# EasyEDA Pro project rm校内赛.eprj

# Schematic Schematic1
Board Name: Board1; Create Date: 2024-11-15; Page Name: P1; Project Name: rm校内赛; Schematic Name: Schematic1; Update Date: 2024-11-25; Company: 嘉立创EDA; Page Size: A4; Version: V1.0
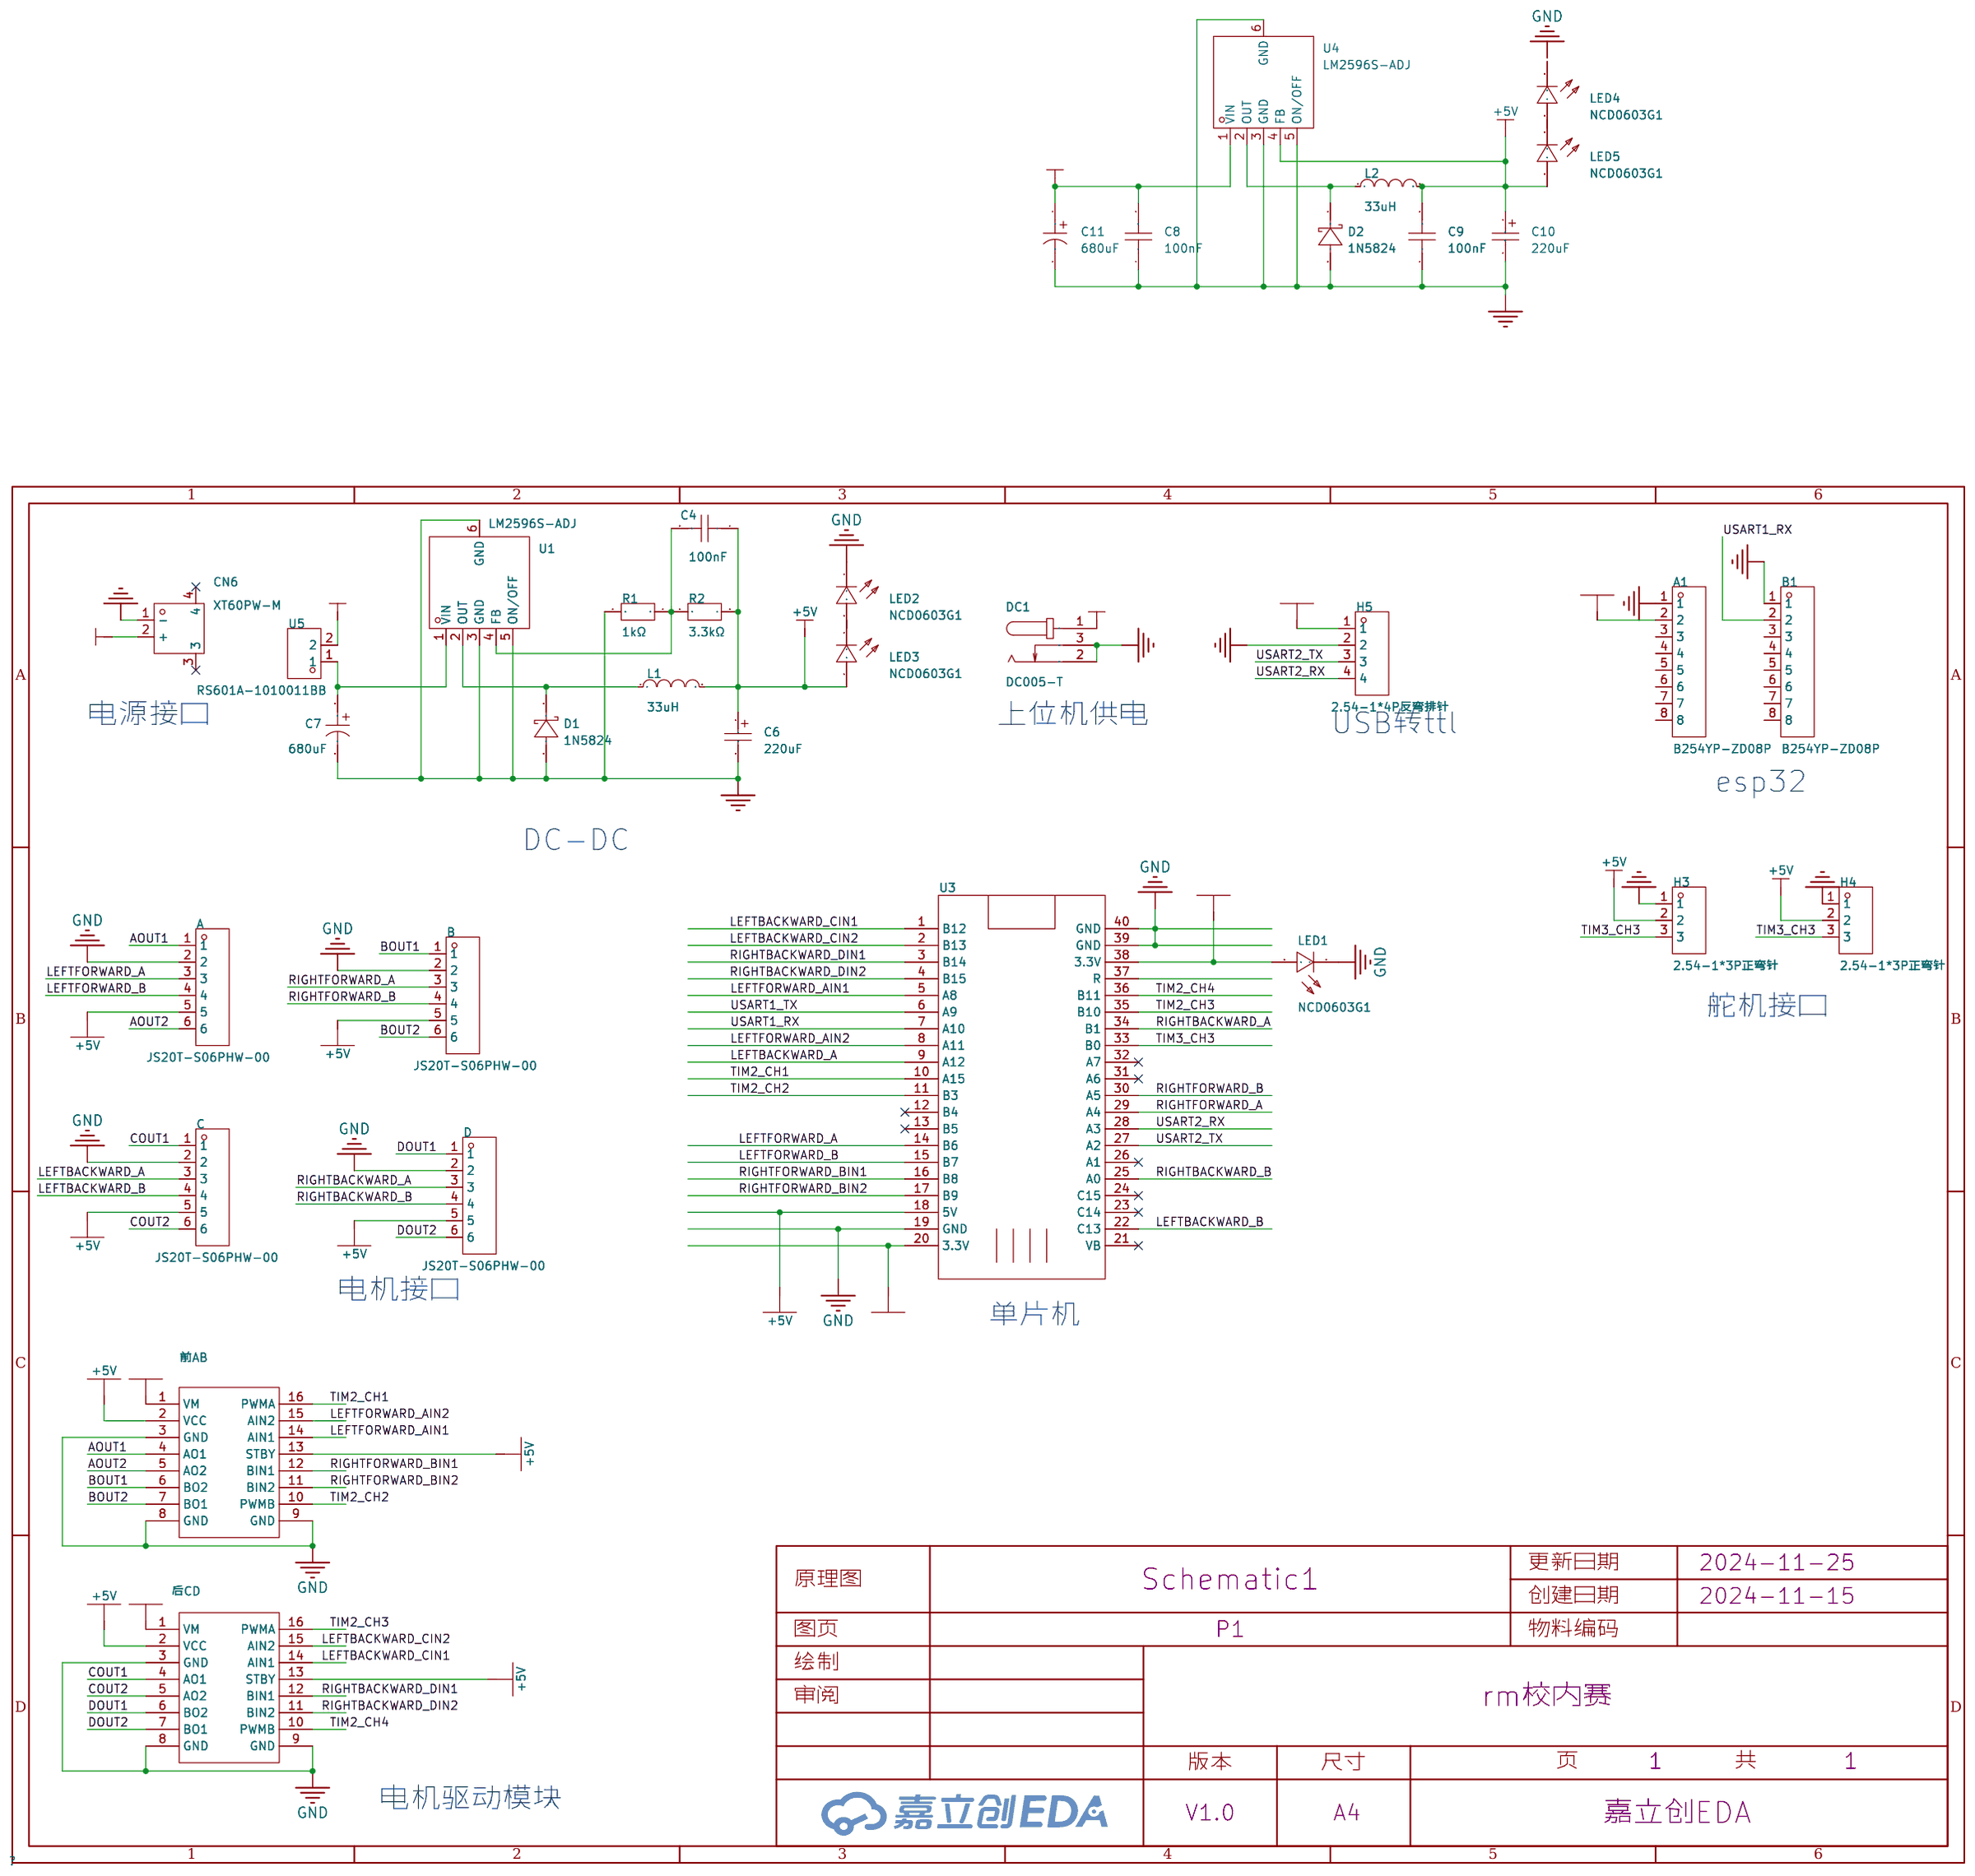
[diagram p0: schematic sheet]

## Parts
A  JS20T-S06PHW-00  [CONN-TH_6P-P2.00_JS20T-S06PHW-00]
A1  B254YP-ZD08P  [HDR-TH_8P-P2.54-V-F]
B  JS20T-S06PHW-00  [CONN-TH_6P-P2.00_JS20T-S06PHW-00]
B1  B254YP-ZD08P  [HDR-TH_8P-P2.54-V-F]
C  JS20T-S06PHW-00  [CONN-TH_6P-P2.00_JS20T-S06PHW-00]
C4  100nF  [C0603]
C6  220uF  [CASE-B_3528]
C7  680uF  [CAP-SMD_BD10.0-L10.3-W10.3-LS10.9-FD]
C8  100nF  [C0603]
C9  100nF  [C0603]
C10  220uF  [CASE-B_3528]
C11  680uF  [CAP-SMD_BD10.0-L10.3-W10.3-LS10.9-FD]
CN6  XT60PW-M  [CONN-TH_XT60PW-M]
D  JS20T-S06PHW-00  [CONN-TH_6P-P2.00_JS20T-S06PHW-00]
D1  1N5824  [DO-27_BD5.3-L8.4-P12.40-D1.3-RD]
D2  1N5824  [DO-27_BD5.3-L8.4-P12.40-D1.3-RD]
DC1  DC005-T  [DC-IN-TH_DC005-T]
H3  2.54-1*3P正弯针  [HDR-TH_3P-P2.54-H-M-BW7.2-P]
H4  2.54-1*3P正弯针  [HDR-TH_3P-P2.54-H-M-BW7.2-P]
H5  2.54-1*4P反弯排针  [HDR-TH_4P-P2.54-H-M-W10.4]
L1  33uH  [IND-SMD_L7.0-W6.6_FXL0630]
L2  33uH  [IND-SMD_L7.0-W6.6_FXL0630]
LED1  NCD0603G1  [LED0603-RD_1]
LED2  NCD0603G1  [LED0603-RD_1]
LED3  NCD0603G1  [LED0603-RD_1]
LED4  NCD0603G1  [LED0603-RD_1]
LED5  NCD0603G1  [LED0603-RD_1]
R1  1kΩ  [R0603]
R2  3.3kΩ  [R0603]
U1  LM2596S-ADJ  [TO-263-5_L10.0-W8.4-P1.70-LS15.3-BR]
U3  -  [STM32F103C8T6核心板]
U4  LM2596S-ADJ  [TO-263-5_L10.0-W8.4-P1.70-LS15.3-BR]
U5  RS601A-1010011BB  [SW-TH_RS601A-1010011BB]
前AB  -  [TB6612FNG Module - 8pin x 2]
后CD  -  [TB6612FNG Module - 8pin x 2]

## Library data of the parts
A B C D = JS20T-S06PHW-00: Supplier Part: C7499306; Manufacturer: JS(钜硕电子); Supplier Footprint: 插件,P=2.0mm; JLCPCB Part Class: 扩展库; Datasheet: https://atta.szlcsc.com/upload/public/pdf/source/20230809/E6337CD797A912ED7011A9EA7A78FFDE.pdf; Supplier: LCSC; Pins Structure: 1x6P; Pitch: 2mm; Mounting Style: 弯插; Reference Series: PH; Number of Pins: 6P; Number of Rows: 1; Number of PINs Per Row: 6; Contact Material: 黄铜; Check: false
A1 B1 = B254YP-ZD08P: LCSC Part Name: 排母 间距：2.54mm 1x8P 直插 方孔; Supplier Part: C41413862; Manufacturer: BXCONN(宝讯); Supplier Footprint: 插件,P=2.54mm; JLCPCB Part Class: 扩展库; Datasheet: https://atta.szlcsc.com/upload/public/pdf/source/20240923/74E2CE436646B459B413A9EB99F952A2.pdf; Supplier: LCSC; Holes Structure: 1x8P; Pitch: 2.54mm; Circular Hole / Square Hole: 方孔; Mounting Type: 直插; Number of Rows: 单排; Number of Holes: 8P; Current Rating (Max): 3A; Holes Direction: 顶部; Insulation Height: 8.5mm; Operating Temperature Range: -40℃~+105℃; Check: false
C4 C8 C9 = 06035L104K4T2A: LCSC Part Name: 100nF ±10% 50V; Supplier Part: C2167596; Manufacturer: Kyocera AVX; Supplier Footprint: 0603; JLCPCB Part Class: 扩展库; Datasheet: https://atta.szlcsc.com/upload/public/pdf/source/20211207/6F4035DE01556DFAFEB5EDE5432599E9.pdf; Supplier: LCSC; Tolerance: ±10%; Voltage Rated: 50V; Temperature Coefficient: X8L
C6 C10 = TLJB227M006R0500: LCSC Part Name: 220uF ±20% 6.3V; Supplier Part: C30242; Manufacturer: Kyocera AVX; Supplier Footprint: CASE-B-3528; JLCPCB Part Class: 扩展库; Datasheet: https://atta.szlcsc.com/upload/public/pdf/source/20181016/C313517_95E099C94D57B8A6005DAF15C3058A23.pdf; Supplier: LCSC; Tolerance: ±20%; Rated Voltage: 6.3V; Equivalent Series Resistance(ESR): 500mΩ@100kHz; Operating Temperature: -55℃~+125℃
C7 C11 = GVM1V681M1010: LCSC Part Name: 680uF ±20% 35V; Supplier Part: C2980172; Manufacturer: HONOR(荣誉); Supplier Footprint: SMD,D10xL10.5mm; JLCPCB Part Class: 扩展库; Datasheet: https://atta.szlcsc.com/upload/public/pdf/source/20220509/EB2A569F0F3393644DE07704993C28AA.pdf; Supplier: LCSC; Tolerance: ±20%; Rated Voltage: 35V; Ripple Current: 1.19A@120Hz; Equivalent Series Resistance(ESR): 60mΩ@120Hz; φD: 10mm; L: 10.2mm; Lifetime @ Temp: 5000hrs@105℃; Operating Temperature: -55℃~+105℃
CN6 = XT60PW-M: LCSC Part Name: AMASS(艾迈斯)航模插头xt60连接器150公母对接pw锂电池公头 板插卧式XT60PW-M; Supplier Part: C98732; Manufacturer: AMASS(艾迈斯); JLCPCB Part Class: 扩展库; Datasheet: https://atta.szlcsc.com/upload/public/pdf/source/20240118/44A3DCFF53BE25DC65378AFFB21277A4.pdf; Supplier: LCSC; Brand: 艾迈斯; Type: 卧式插头; Colour: 黄色; InterfaceType: 公头
D1 D2 = 1N5824_C7503125: LCSC Part Name: 电压:30V 电流:5A; Supplier Part: C7503125; Manufacturer: FUXINSEMI(富芯森美); Supplier Footprint: DO-201AD; JLCPCB Part Class: 扩展库; Datasheet: https://atta.szlcsc.com/upload/public/pdf/source/20230904/20F3394C6D1B7A17743713246CA97DB3.pdf; Supplier: LCSC; Diode Configuration: 独立式; Forward Voltage (Vf@If): 550mV@5A; Reverse Voltage (Vr): 30V; Average Rectified Current (Io): 5A; Reverse Leakage Current (Ir): 500uA@30V; Peak forward surge current: 150A
DC1 = DC005-T: LCSC Part Name: DC电源插座 内径:2mm 外径:6.3mm; Supplier Part: C431532; Manufacturer: SHOU HAN(首韩); Supplier Footprint: 插件; JLCPCB Part Class: 扩展库; Datasheet: https://atta.szlcsc.com/upload/public/pdf/source/20190925/C431532_27AF2D37554BC0900100E1656035C16A.pdf; Supplier: LCSC; Connector Type: DC电源插座; Mounting Style: 弯插; Inside Contact Diameter: 2mm; Outside Contact Diameter: 6.3mm; Current Rating (Max): 500mA; Voltage Rating (Max): 30V; Operating Temperature Range: -40℃~+55℃
H3 H4 = 2.54-1*3P正弯针: LCSC Part Name: 间距:2.54mm 1x3P 弯插 方针; Supplier Part: C92159; Manufacturer: BOOMELE(博穆精密); Supplier Footprint: 弯插,P=2.54mm; JLCPCB Part Class: 扩展库; Datasheet: https://atta.szlcsc.com/upload/public/pdf/source/20181121/C2334_B051029C4931EB562F9DCCAAD18AC88A.pdf; Supplier: LCSC; Pin Structure: 1x3P; Pitch: 2.54mm; Circluar Pins/Square Pins: 方针; Mounting Type: 弯插; Number of Rows: 单排; Number of Pins: 3P; Current Rating (Max): 3A; Length of Mating Pin: 3mm; Insulation Height: 2.54mm; Operating Temperature Range: -55℃~+105℃; Color: 黑色
H5 = 2.54-1*4P反弯排针: LCSC Part Name: 间距:2.54mm 1x4P 弯插 方针; Supplier Part: C91552; Manufacturer: BOOMELE(博穆精密); Supplier Footprint: 弯插,P=2.54mm; JLCPCB Part Class: 扩展库; Datasheet: https://atta.szlcsc.com/upload/public/pdf/source/20190508/C74252_03DDEC4696EE17172E44B96636392962.pdf; Supplier: LCSC; Pin Structure: 1x4P; Pitch: 2.54mm; Circluar Pins/Square Pins: 方针; Mounting Type: 弯插; Number of Rows: 单排; Number of Pins: 4P; Current Rating (Max): 3A; Length of Mating Pin: 6mm; Operating Temperature Range: -55℃~+105℃; Color: 黑色
L1 L2 = FXL0630-330-M: LCSC Part Name: 33uH ±20% 2.5A; Supplier Part: C177245; Manufacturer: cjiang(长江微电); Supplier Footprint: SMD,6.6x7mm; JLCPCB Part Class: 扩展库; Datasheet: https://atta.szlcsc.com/upload/public/pdf/source/20240426/3189EA8206330E2108542F9E34E540E7.pdf; Supplier: LCSC; Tolerance: ±20%; Rated Current: 2A; Saturation Current (Isat): 2.5A; DC Resistance (DCR): 310mΩ; Type: 一体成型电感
LED1-LED5 = NCD0603G1: Supplier Part: C84267; Manufacturer: 国星光电; Supplier Footprint: 0603; JLCPCB Part Class: 扩展库; Datasheet: https://atta.szlcsc.com/upload/public/pdf/source/20200820/C84267_04BA7703640BAC111D09F5EFB971FBF3.pdf; Supplier: LCSC; Emitted Color: 翠绿色; Forward Voltage (VF): 2.6V~3.6V; Power Dissipation: 72mW; Forward Current: 10mA; Dominant Wavelength: 515nm~530nm; Lens Color: 无色透明透镜; Luminous Intensity: 330mcd~900mcd; Viewing Angle: 130°; Operating Temperature: -30℃~+85℃
R1 R2 = FRC0603J103TS: LCSC Part Name: 10kΩ ±5% 100mW 厚膜电阻; Supplier Part: C2930027; Manufacturer: FOJAN(富捷); Supplier Footprint: 0603; JLCPCB Part Class: Extended Part; Datasheet: https://atta.szlcsc.com/upload/public/pdf/source/20211221/925EC7D7225764EE0046F22065062C87.pdf; Supplier: LCSC; Type: 厚膜电阻; Tolerance: ±5%; Power(Watts): 100mW; Overload Voltage (Max): 75V; Temperature Coefficient: ±100ppm/℃; Operating Temperature Range: -55℃~+155℃
U1 U4 = LM2596S-ADJ_C5349987: Supplier Part: C5349987; Manufacturer: HXY MOSFET(华轩阳电子); Supplier Footprint: TO-263-5L; JLCPCB Part Class: 扩展库; Datasheet: https://atta.szlcsc.com/upload/public/pdf/source/20230111/199BC35A7A4D0647B85E7DE5CE9FEA7F.pdf; Supplier: LCSC; Function: 降压型; Output Type: 可调; Input Voltage: 40V; Output Voltage: 1.23V~37V; Output Current (Max): 3.5A; Operating Temperature: -40℃~+125℃; Number of Outputs: 1; Switch tube (built-in/external): 内置
U3 = stm32f103c8t6最小系统板: Check: false
U5 = RS601A-1010011BB_C2885779: Supplier Part: C2885779; Manufacturer: HCTL(华灿天禄); Supplier Footprint: 插件; JLCPCB Part Class: 扩展库; Datasheet: https://atta.szlcsc.com/upload/public/pdf/source/20210820/CD80D5B25FB294BFDCE06549B0FB3C50.pdf; Supplier: LCSC; Switch Length: 21mm; Switch Width: 15mm; Switch Height: 13.6mm; Actuator Type: 凹面弯曲; With Lamp: 无; Pin Style: 焊片; Actuator Color: 黑色; Contact Current: 6A; Voltage Rating (AC): 250V; Circuit: 单刀单掷; Mechanical Life: 1万次; Operating Temperature: -25℃~+85℃; Actuator Identifier: - O
前AB 后CD = TB6612FNG模块: Pin Type: In; Check: false

## Nets
+3.3V: A1.2 H5.1 LED1.2(A) U3.20(3.3V) U3.38(3.3V)
+5V: A.5 B.5 C.5 C4.1 C6.1 C9.2 C10.1 D.5 H3.2 H4.2 L1.2 L2.2 LED3.2(A) LED5.2(A) R2.2 U3.18(5V) U4.4(FB) 前AB.2(VCC) 前AB.13(STBY) 后CD.2(VCC) 后CD.13(STBY)
+12V: C8.2 C11.1 CN6.2(+) DC1.1 U4.1(VIN) 前AB.1(VM) 后CD.1(VM)
+12VIN: U5.2
GND: A.2 A1.1 B.2 B1.1 C.2 C6.2 C7.2 C8.1 C9.1 C10.2 C11.2 CN6.1(-) D.2 D1.2(A) D2.2(A) DC1.2 DC1.3 H3.1 H4.1 H5.2 LED1.1(K) LED2.1(K) R1.2 U1.3(GND) U1.5(ON/OFF) U1.6(GND) U3.19(GND) U3.39(GND) U3.40(GND) U4.3(GND) U4.5(ON/OFF) U4.6(GND) 前AB.3(GND) 前AB.8(GND) 前AB.9(GND) 后CD.3(GND) 后CD.8(GND) 后CD.9(GND)
AOUT1: A.1 前AB.4(AO1)
AOUT2: A.6 前AB.5(AO2)
BOUT1: B.1 前AB.6(BO2)
BOUT2: B.6 前AB.7(BO1)
COUT1: C.1 后CD.4(AO1)
COUT2: C.6 后CD.5(AO2)
DOUT1: D.1 后CD.6(BO2)
DOUT2: D.6 后CD.7(BO1)
LEFTBACKWARD_A: C.3 U3.9(A12)
LEFTBACKWARD_B: C.4 U3.22(C13)
LEFTBACKWARD_CIN1: U3.1(B12) 后CD.14(AIN1)
LEFTBACKWARD_CIN2: U3.2(B13) 后CD.15(AIN2)
LEFTFORWARD_A: A.3 U3.14(B6)
LEFTFORWARD_AIN1: U3.5(A8) 前AB.14(AIN1)
LEFTFORWARD_AIN2: U3.8(A11) 前AB.15(AIN2)
LEFTFORWARD_B: A.4 U3.15(B7)
RIGHTBACKWARD_A: D.3 U3.34(B1)
RIGHTBACKWARD_B: D.4 U3.25(A0)
RIGHTBACKWARD_DIN1: U3.3(B14) 后CD.12(BIN1)
RIGHTBACKWARD_DIN2: U3.4(B15) 后CD.11(BIN2)
RIGHTFORWARD_A: B.3 U3.29(A4)
RIGHTFORWARD_B: B.4 U3.30(A5)
RIGHTFORWARD_BIN1: U3.16(B8) 前AB.12(BIN1)
RIGHTFORWARD_BIN2: U3.17(B9) 前AB.11(BIN2)
TIM2_CH1: U3.10(A15) 前AB.16(PWMA)
TIM2_CH2: U3.11(B3) 前AB.10(PWMB)
TIM2_CH3: U3.35(B10) 后CD.16(PWMA)
TIM2_CH4: U3.36(B11) 后CD.10(PWMB)
TIM3_CH3: H3.3 H4.3 U3.33(B0)
USART1_RX: B1.2 U3.7(A10)
USART1_TX: U3.6(A9)
USART2_RX: H5.4 U3.28(A3)
USART2_TX: H5.3 U3.27(A2)
$1N880: D1.1(K) L1.1 U1.2(OUT)
$1N5309: LED2.2(A) LED3.1(K)
$1N7844: C4.2 R1.1 R2.1 U1.4(FB)
Net-(C7-1): C7.1 U1.1(VIN) U5.1
Net-(D2-1): D2.1(K) L2.1 U4.2(OUT)
Net-(LED4-2): LED4.2(A) LED5.1(K)

Not connected (* = marked no-connect by the designer): A1 3 4 5 6 7 8; B1 3 4 5 6 7 8; CN6 3* 4*; LED4 1(K); U3 12(B4)* 13(B5)* 21(VB)* 23(C14)* 24(C15)* 26(A1)* 31(A6)* 32(A7)* 37(R)

## Notes on the sheet
- 电源接口
- 上位机供电
- USB转ttl
- esp32
- DC-DC
- 舵机接口
- 电机接口
- 单片机
- 电机驱动模块

# Board PCB1
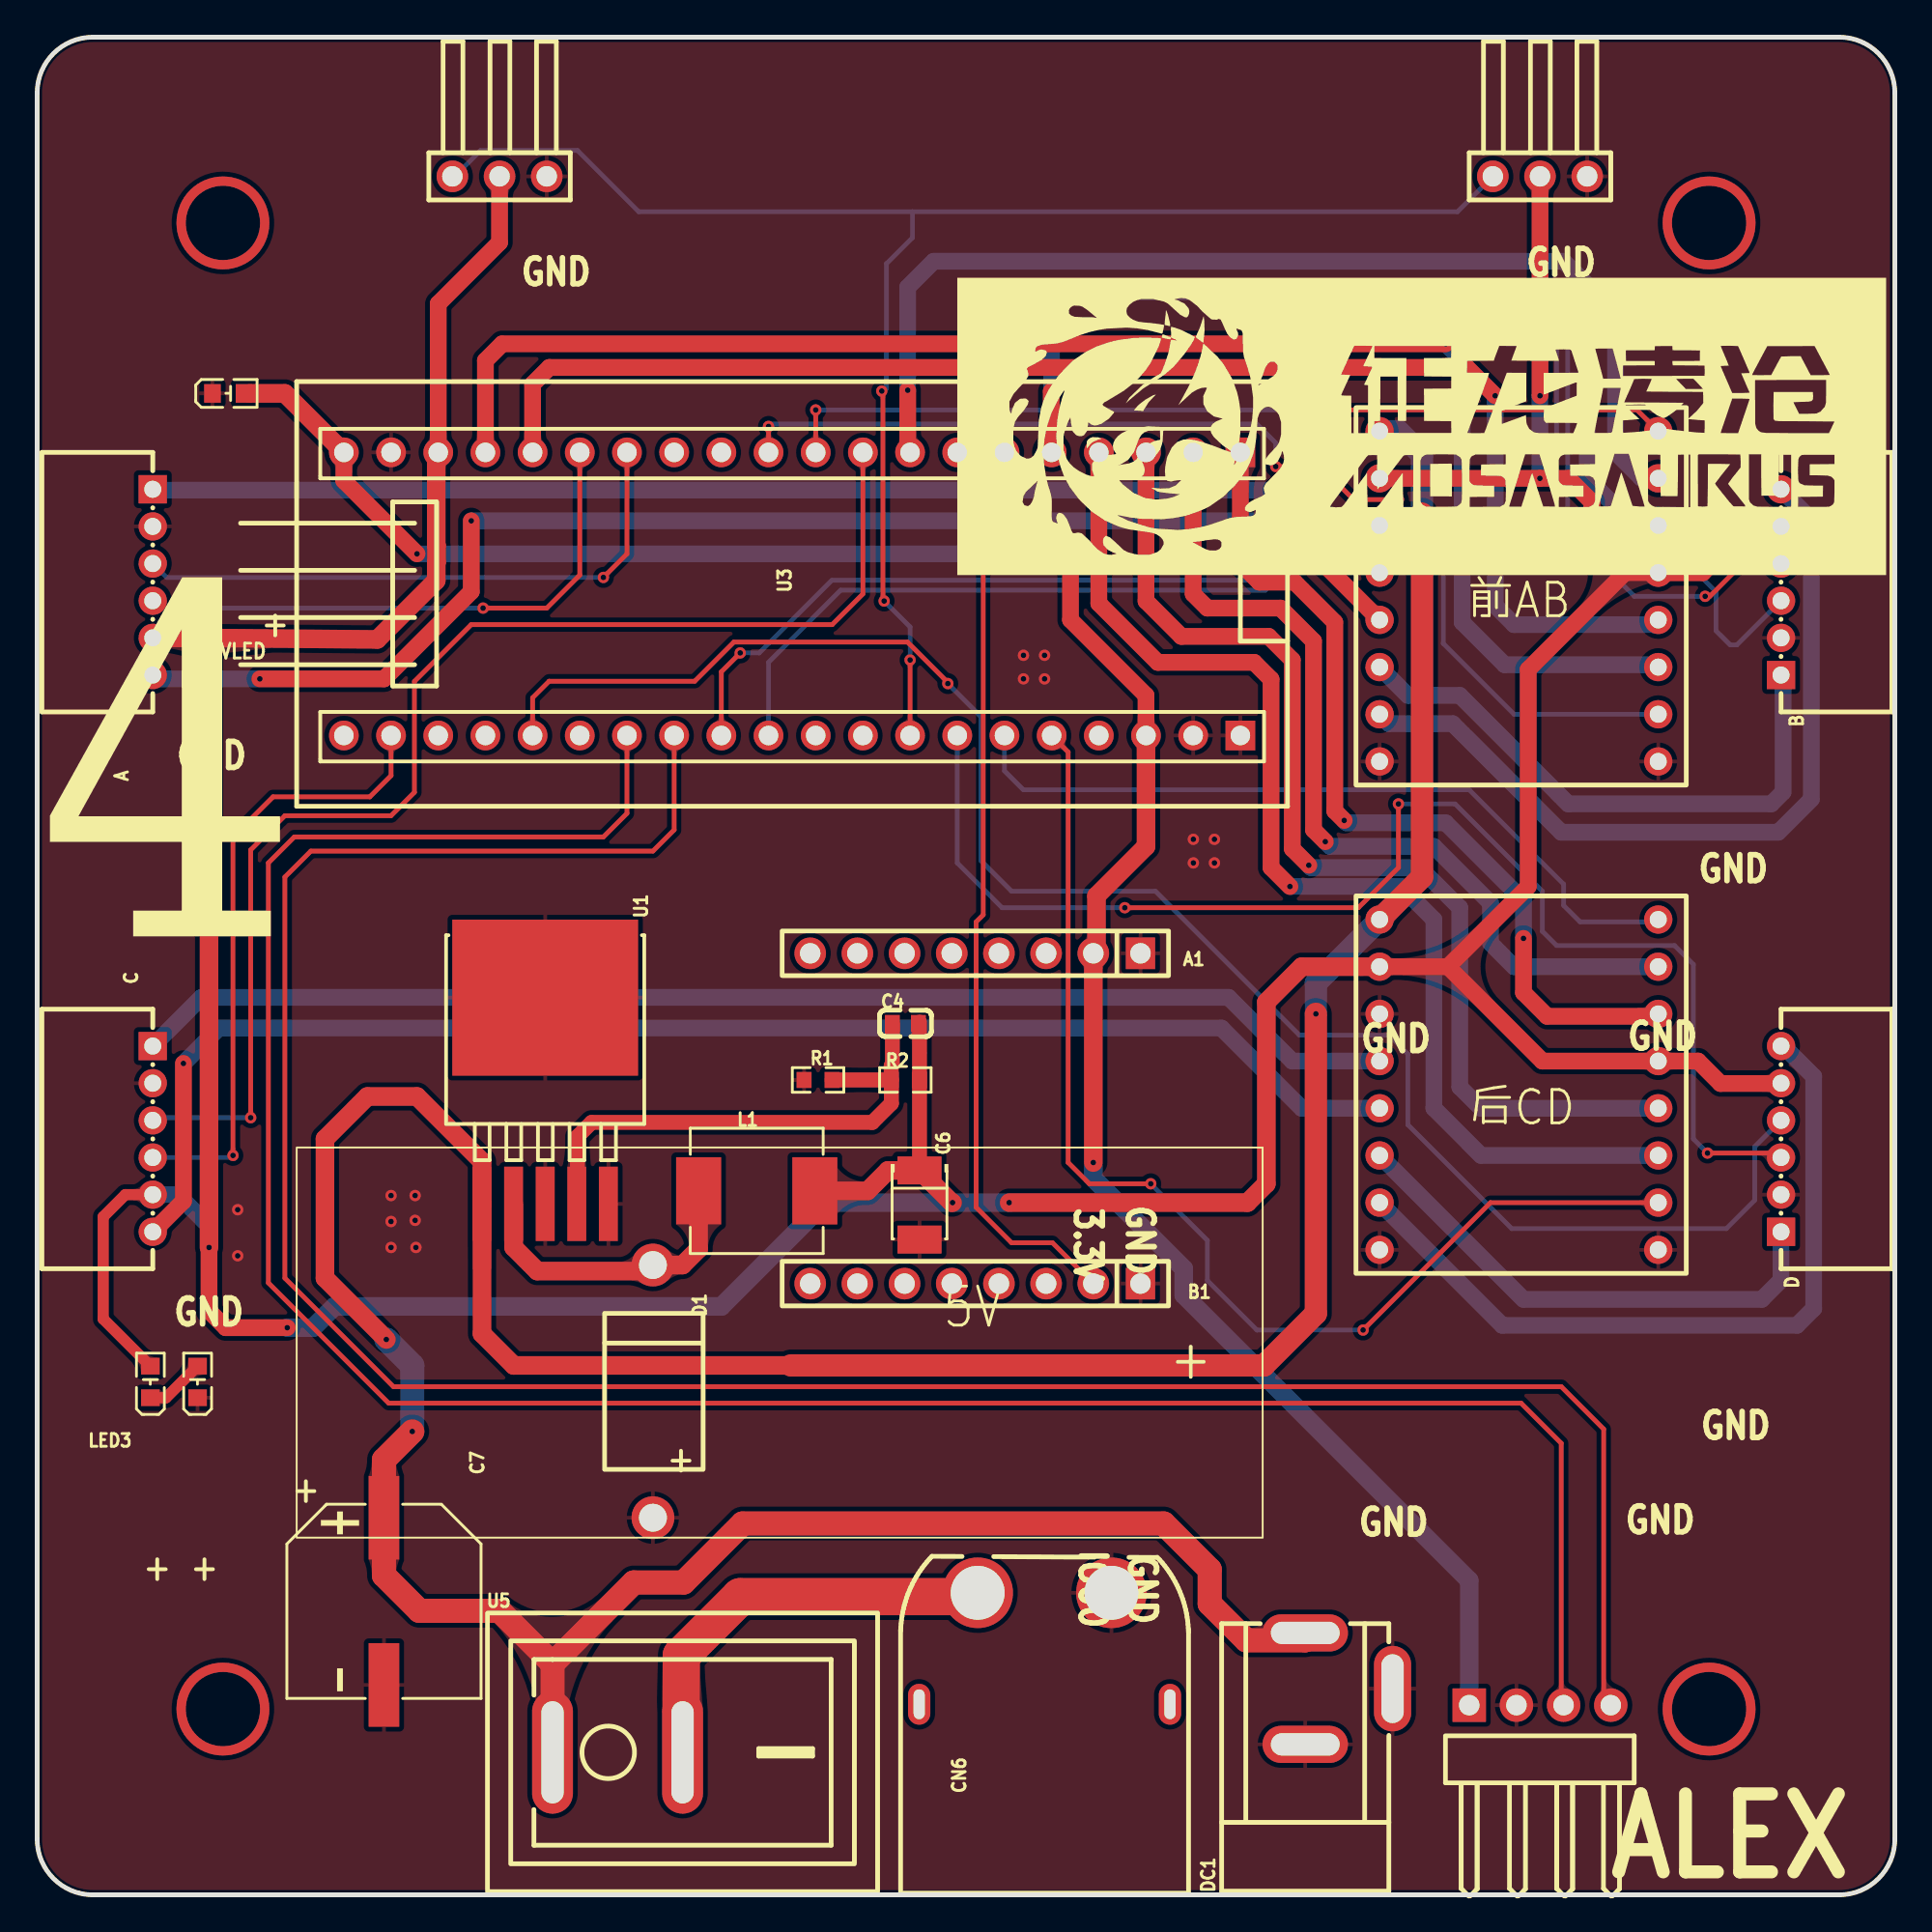
[diagram p1: board, top side]
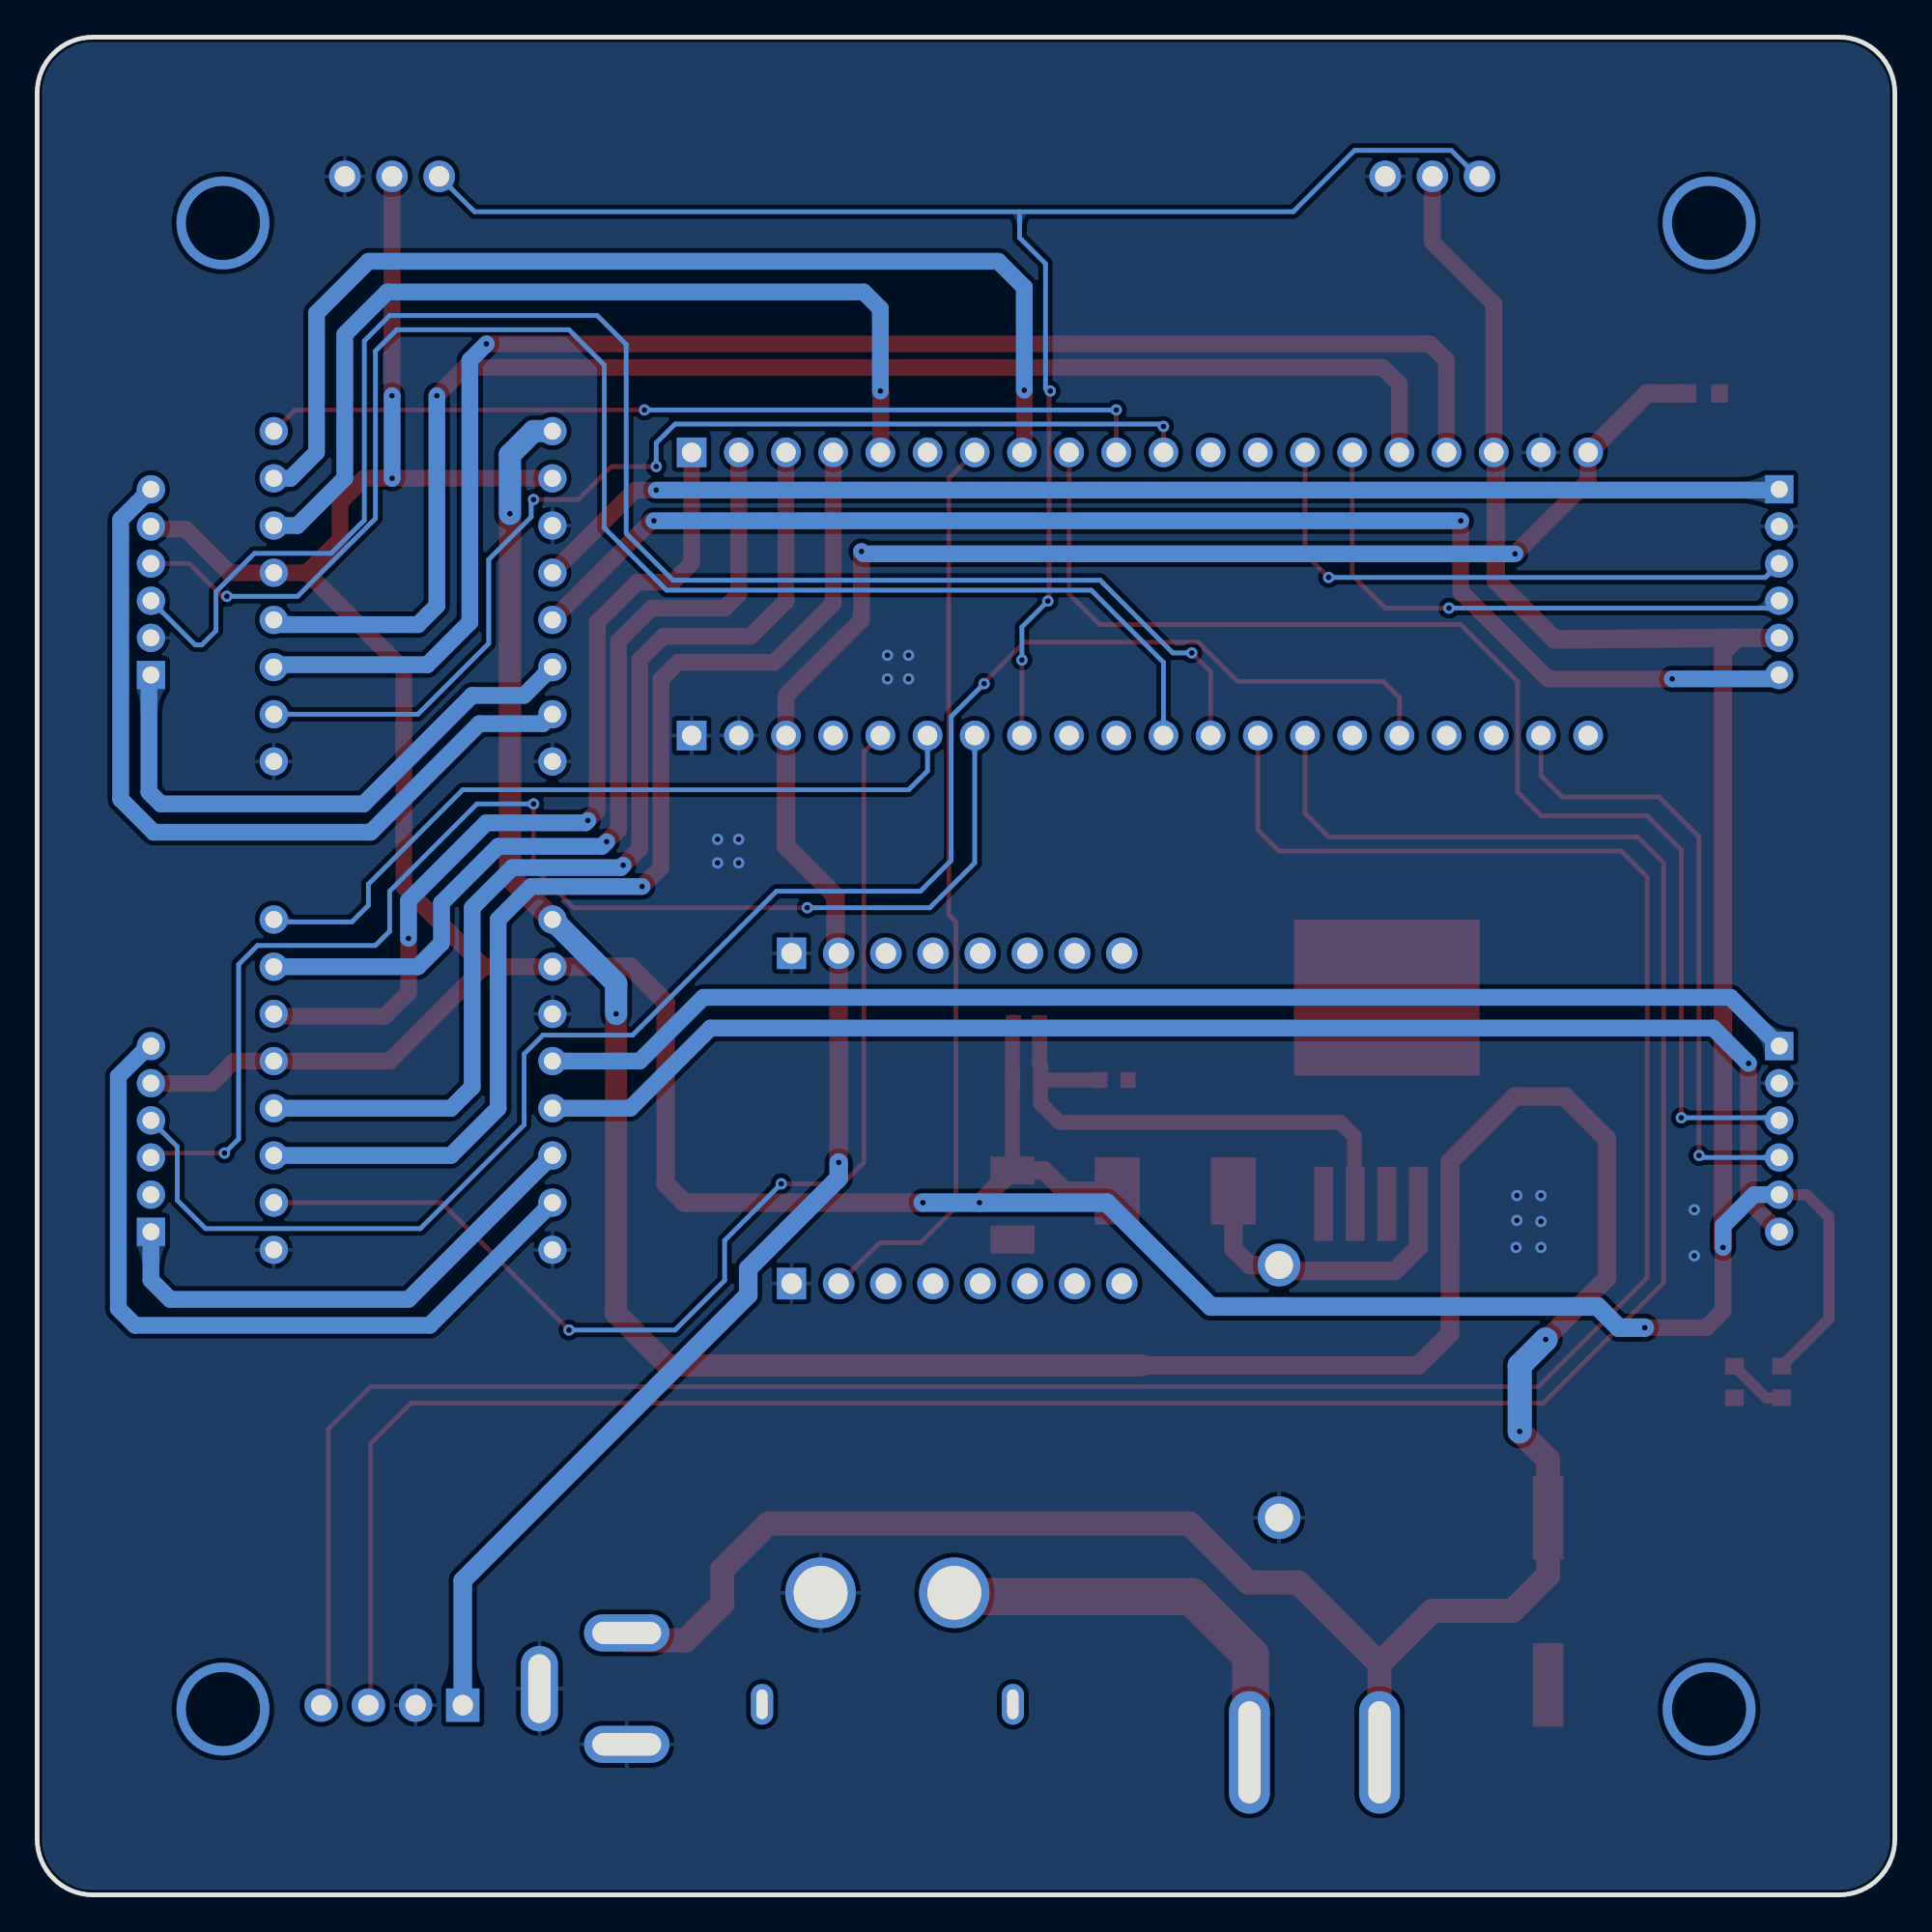
[diagram p2: board, bottom side, seen from below]

Outline 100 x 100 mm; copper layers: Top Layer, Bottom Layer. Coordinates in mm from the lower left corner of the outline.
Outline path: 0,97 0,3 arc(0.88,0.88) 3,0 97,0 arc(99.12,0.88) 100,3 100,97 arc(99.12,99.12) 97,100 3,100 arc(0.88,99.12) 0,97
Stack: Top Layer 0.035mm / Dielectric1 1.51mm FR4 er 4.5 / Bottom Layer 0.035mm

## Design rules (mm)
template: JLCPCB Capability(Two Layers Board)
spacing copperThickness1oz (default): track to track 0.102, other pairs 0.152 to 0.3
spacing copperThickness2oz: track to track 0.203, other pairs 0.152 to 0.3
track width copperThickness1oz (default): min 0.127, default 0.254, max 2.54
track width copperThickness2oz: min 0.203, default 0.254, max 2.54
differential pair differentialPair (default): width min 0.127, default 0.254, max 2.54; gap min 0.152, default 0.152
via viaSize (default): diameter min 0.5, default 0.61, max 10; hole min 0.3, default 0.305, max 6.3

## Placement (name value [footprint] x y rotation side)
A  JS20T-S06PHW-00  [CONN-TH_6P-P2.00_JS20T-S06PHW-00]  6.22 70.66 270 top
A1  B254YP-ZD08P  [HDR-TH_8P-P2.54-V-F]  50.5 50.68 180 top
B  JS20T-S06PHW-00  [CONN-TH_6P-P2.00_JS20T-S06PHW-00]  93.87 70.66 90 top
B1  B254YP-ZD08P  [HDR-TH_8P-P2.54-V-F]  50.5 32.9 180 top
C  JS20T-S06PHW-00  [CONN-TH_6P-P2.00_JS20T-S06PHW-00]  6.22 40.69 270 top
C4  100nF  [C0603]  46.74 46.91 180 top
C6  220uF  [CASE-B_3528]  47.5 37.14 270 top
C7  680uF  [CAP-SMD_BD10.0-L10.3-W10.3-LS10.9-FD]  18.67 15.8 270 top
CN6  XT60PW-M  [CONN-TH_XT60PW-M]  54.23 13.26 90 top
D  JS20T-S06PHW-00  [CONN-TH_6P-P2.00_JS20T-S06PHW-00]  93.87 40.69 90 top
D1  1N5824  [DO-27_BD5.3-L8.4-P12.40-D1.3-RD]  33.15 27.1 270 top
DC1  DC005-T  [DC-IN-TH_DC005-T]  70.61 11.1 90 top
H3  2.54-1*3P正弯针  [HDR-TH_3P-P2.54-H-M-BW7.2-P]  24.89 92.51 180 top
H4  2.54-1*3P正弯针  [HDR-TH_3P-P2.54-H-M-BW7.2-P]  80.9 92.51 180 top
H5  2.54-1*4P反弯排针  [HDR-TH_4P-P2.54-H-M-W10.4]  80.9 10.21 0 top
L1  33uH  [IND-SMD_L7.0-W6.6_FXL0630]  38.74 37.9 180 top
LED1  NCD0603G1  [LED0603-RD_1]  10.29 80.82 0 top
LED2  NCD0603G1  [LED0603-RD_1]  8.64 27.61 90 top
LED3  NCD0603G1  [LED0603-RD_1]  6.1 27.61 90 top
R1  1kΩ  [R0603]  42.04 43.87 180 top
R2  3.3kΩ  [R0603]  46.74 43.87 0 top
U1  LM2596S-ADJ  [TO-263-5_L10.0-W8.4-P1.70-LS15.3-BR]  27.35 42.75 270 top
U3  -  [STM32F103C8T6核心板]  40.64 70.03 270 top
U5  RS601A-1010011BB  [SW-TH_RS601A-1010011BB]  31.24 7.67 0 top
前AB  -  [TB6612FNG Module - 8pin x 2]  79.88 69.9 0 top
后CD  -  [TB6612FNG Module - 8pin x 2]  79.88 43.61 0 top

## Footprints (pads in the part's own frame, mm; a bottom-side part is the same pattern mirrored in y, then rotated)
C0603
  rect 0.8x0.9 smd: 1(-0.7,0) 2(0.7,0)
CAP-SMD_BD10.0-L10.3-W10.3-LS10.9-FD
  rect 4.5x1.65 smd: 1(-4.5,0) 2(4.5,0)
CASE-B_3528
  rect 1.506x2.376 smd: 1(-1.861,0) 2(1.861,0)
CONN-TH_6P-P2.00_JS20T-S06PHW-00
  rect 1.524x1.524 hole 0.914: 1(-5,0)
  round 1.524 hole 0.914: 2(-3,0) 3(-1,0) 4(1,0) 5(3,0) 6(5,0)
CONN-TH_XT60PW-M
  round 3.8 hole 2.9: 1(3,-3.6) 2(3,3.6)
  oval 2.2x1.2 hole 1.6x0.6: 3(-3,6.75) 4(-3,-6.75)
DC-IN-TH_DC005-T
  oval 2x4.6 hole 1.2x3.7: 1(2.999,2.35) 2(-2.999,2.35)
  oval 4.6x2 hole 3.7x1.2: 3(0,-2.35)
DO-27_BD5.3-L8.4-P12.40-D1.3-RD
  round 2.3 hole 1.5: 1(-6.8,0) 2(6.8,0)
HDR-TH_3P-P2.54-H-M-BW7.2-P
  round 1.7 hole 1.1: 1(-2.54,0) 2(0,0) 3(2.54,0)
HDR-TH_4P-P2.54-H-M-W10.4
  rect 1.8x1.8 hole 1.1: 1(-3.81,0)
  round 1.8 hole 1.1: 2(-1.27,0) 3(1.27,0) 4(3.81,0)
HDR-TH_8P-P2.54-V-F
  rect 1.575x1.7 hole 1.1: 1(-8.89,0)
  round 1.7 hole 1.1: 2(-6.35,0) 3(-3.81,0) 4(-1.27,0) 5(1.27,0) 6(3.81,0) 7(6.35,0) 8(8.89,0)
IND-SMD_L7.0-W6.6_FXL0630
  rect 2.424x3.62 smd: 1(3.128,0) 2(-3.128,0)
LED0603-RD_1
  rect 0.9x1 smd: 1(-0.85,0) 2(0.85,0)
R0603
  rect 0.806x0.864 smd: 1(-0.753,0) 2(0.753,0)
STM32F103C8T6核心板
  rect 1.6x1.6 hole 1.049: 1(-7.62,24.13) 40(7.62,24.13)
  round 1.6 hole 1.049: 2(-7.62,21.59) 3(-7.62,19.05) 4(-7.62,16.51) 5(-7.62,13.97) 6(-7.62,11.43) 7(-7.62,8.89) 8(-7.62,6.35) 9(-7.62,3.81) 10(-7.62,1.27) 11(-7.62,-1.27) 12(-7.62,-3.81) 13(-7.62,-6.35) 14(-7.62,-8.89) 15(-7.62,-11.43) 16(-7.62,-13.97) 17(-7.62,-16.51) 18(-7.62,-19.05) 19(-7.62,-21.59) 20(-7.62,-24.13) 21(7.62,-24.13) 22(7.62,-21.59) 23(7.62,-19.05) 24(7.62,-16.51) 25(7.62,-13.97) 26(7.62,-11.43) 27(7.62,-8.89) 28(7.62,-6.35) 29(7.62,-3.81) 30(7.62,-1.27) 31(7.62,1.27) 32(7.62,3.81) 33(7.62,6.35) 34(7.62,8.89) 35(7.62,11.43) 36(7.62,13.97) 37(7.62,16.51) 38(7.62,19.05) 39(7.62,21.59)
SW-TH_RS601A-1010011BB
  oval 2.2x6.6 hole 1.2x5.5: 1(-3.5,0) 2(3.5,0)
TB6612FNG Module - 8pin x 2
  round 1.524 hole 0.914: 1(-7.62,8.89) 2(-7.62,6.35) 3(-7.62,3.81) 4(-7.62,1.27) 5(-7.62,-1.27) 6(-7.62,-3.81) 7(-7.62,-6.35) 8(-7.62,-8.89) 9(7.38,-8.89) 10(7.38,-6.35) 11(7.38,-3.81) 12(7.38,-1.27) 13(7.38,1.27) 14(7.38,3.81) 15(7.38,6.35) 16(7.38,8.89)
TO-263-5_L10.0-W8.4-P1.70-LS15.3-BR
  rect 4x1.02 smd: 1(5.55,-3.4) 2(5.55,-1.7) 3(5.55,0) 4(5.55,1.7) 5(5.55,3.4)
  rect 8.4x10 smd: 6(-5.55,0)

## Nets
As in the schematic, except:
+12V: C7.1 DC1.1 U1.1 U5.1 前AB.1 后CD.1
+12VIN: CN6.2 U5.2

Pads without a net: A1 3 4 5 6 7 8; B1 3 4 5 6 7 8; CN6 3 4; U3 12 13 21 23 24 26 31 32

## Via types
v1: diameter 5, hole 4, Top Layer to Bottom Layer, 4 vias
v2: diameter 0.61, hole 0.305, Top Layer to Bottom Layer, 62 vias
v3: diameter 0.9, hole 0.305, Top Layer to Bottom Layer, 1 via

## Routing (per net, layer and track width the routed paths; a pad name or vN(x,y) marks a point on that pad's centre or on a via; arc(x,y) is an arc through that point)
+3.3V: length 122.1
  Top Layer w0.9: U3.20 16.51,76.12 v2(20.45,72.19) ; U3.38 59.69,64.57 55.63,68.63 v2(55.63,72.31)
  Top Layer w1: v2(56.85,39.42) A1.2 57.02,50.85 57.02,53.77 59.69,56.44 U3.38 ; U3.20 13.33,80.82 11.43,80.82
  Bottom Layer w0.9: v2(20.45,72.19) 55.5,72.19 v2(55.63,72.31)
  Bottom Layer w1: H5.1 77.09,16.93 61.72,32.29 61.72,33.71 56.85,38.58 v2(56.85,39.42)
+5V: length 278.6
  Top Layer w0.6: C.5 4.75,37.69 3.56,36.5 3.56,31 LED3.2
  Top Layer w0.8: 47.5,46.98 C6.1
  Top Layer w0.9: 75.95,49.96 81.03,44.88 后CD.13 89.41,44.88 90.61,43.68 93.86,43.68 D.5 ; 75.95,49.96 80.26,54.28 80.26,65.96 85.47,71.17 ; 75.95,49.96 后CD.2 ; v2(13.46,30.53) 10.15,30.53 9.25,31.43 v2(9.25,34.85) ; 85.47,71.17 89.66,71.17 92.01,73.52 93.73,73.52 B.5 ; 85.47,71.17 83.69,72.95 83.69,74.98 82.42,76.25 v3(80.89,76.25) 72.26,76.25 ; v2(80.9,80.7) H4.2 ; H3.2 24.89,88.95 21.59,85.65 U3.18
  Top Layer w1: 后CD.2 68.07,49.96 66.17,48.06 66.17,38.28 65.15,37.26 v2(52.32,37.26) ; v2(9.25,34.85) 9.25,66.91 8.5,67.66 ; 8.42,67.66 8.5,67.66 ; 8.42,67.66 8.5,67.66 ; 8.42,67.66 A.5 ; 8.5,67.66 18.31,67.58 21.48,70.75 21.48,71.73 21.5,71.75 21.5,72.62 21.48,72.64 21.48,77.54 U3.18 ; v2(49.28,37.26) 49.23,37.26 C6.1 45.8,39 44.7,37.9 L1.2
  Bottom Layer w0.9: 6.48,37.69 7.57,37.69 9.25,36.01 v2(9.25,34.85) ; v3(80.89,76.25) 80.89,80.69 v2(80.9,80.7)
  Bottom Layer w1: v2(52.32,37.26) v2(49.28,37.26) 42.42,37.26 36.83,31.67 16,31.67 14.86,30.53 v2(13.46,30.53)
+12V: length 207.9
  Top Layer w1: v2(18.8,29.9) 15.49,33.2 15.49,40.69 17.78,42.98 20.45,42.98 23.95,39.48 U1.1 23.95,30.21 25.65,28.5 40.58,28.5
  Top Layer w1.2: 后CD.1 74.55,54.79 v2(74.55,74.35) ; v2(68.83,47.42) 68.83,31.29 66.04,28.5 40.58,28.5
  Top Layer w1.3: U5.1 27.74,12.44 ; 27.74,12.44 32.12,16.81 34.8,16.81 37.97,19.99 60.64,19.99 63.12,17.51 63.12,15.67 65.09,13.7 68.25,13.7 68.26,13.72 DC1.1 ; 27.74,12.44 24.89,15.29 20.57,15.29 18.67,17.2 C7.1 18.67,23.42 v2(20.19,24.94)
  Bottom Layer w1.2: 后CD.1 68.83,49.07 v2(68.83,47.42) ; 前AB.1 73.28,78.79 74.55,77.52 v2(74.55,74.35)
  Bottom Layer w1.3: v2(18.8,29.9) 20.19,28.5 v2(20.19,24.94)
+12VIN: length 21
  Top Layer w2: 50.5,16.26 50.3,16.05 37.85,16.05 34.67,12.88 34.67,9.12
GND:
  vias: v2(10.8,36.88) v2(10.8,34.4) v2(19.05,37.64) v2(19.05,36.25) v2(19.05,34.85) v2(20.35,37.64) v2(20.35,36.31) v2(20.39,34.85) v2(53.09,66.73) v2(53.09,65.46) v2(54.23,66.73) v2(54.23,65.46) v2(62.24,56.82) v2(62.24,55.55) v2(63.37,56.82) v2(63.37,55.55)
(no net):
  vias: v1(10,90) v1(10,10) v1(90,90) v1(90,10)
AOUT1: length 67.9
  Top Layer w0.9: v2(66.68,75.62) 67.82,75.62 72.26,71.17
  Bottom Layer w0.9: A.1 6.27,75.62 v2(66.68,75.62)
AOUT2: length 74.1
  Top Layer w0.9: v2(23.37,73.97) 23.37,70.16 18.67,65.46 v2(11.99,65.46) ; 前AB.5 66.93,73.97 v2(66.8,73.97)
  Bottom Layer w0.9: v2(66.8,73.97) v2(23.37,73.97) ; v2(11.99,65.46) 6.43,65.46 A.6
BOUT1: length 31.4
  Bottom Layer w0.9: B.1 93.98,65.55 93.98,59.36 93.34,58.72 82.42,58.72 76.58,64.57 73.79,64.57 前AB.6
BOUT2: length 44
  Bottom Layer w0.9: B.6 95.5,74.03 95.5,58.98 93.73,57.2 82.04,57.2 76.2,63.04 72.77,63.04 前AB.7
COUT1: length 68.5
  Bottom Layer w0.9: C.1 8.84,48.31 64.13,48.31 67.56,44.88 后CD.4
COUT2: length 76.7
  Top Layer w0.9: C.6 7.87,37.34 v2(7.87,44.75)
  Bottom Layer w0.9: 后CD.5 68.07,42.34 63.75,46.66 9.78,46.66 v2(7.87,44.75)
DOUT1: length 27.8
  Bottom Layer w0.9: 后CD.6 80.01,32.06 92.84,32.06 93.87,33.09 D.1
DOUT2: length 41.4
  Bottom Layer w0.9: D.6 94,45.69 95.63,44.06 95.63,31.56 94.73,30.66 78.87,30.66 后CD.7
LEFTBACKWARD_A: length 69.5
  Top Layer w0.254: v2(11.49,41.83) 11.49,56.25 13.33,58.09 19.05,58.09 20.31,59.35 20.31,65.32 23.37,68.38 42.8,68.38 44.45,70.03 U3.9
  Bottom Layer w0.254: C.3 6.37,41.83 v2(11.49,41.83)
LEFTBACKWARD_B: length 33.5
  Top Layer w0.254: U3.22 19.05,60.25 17.91,59.11 12.7,59.11 10.54,56.95 v2(10.54,39.8)
  Bottom Layer w0.254: v2(10.54,39.8) 10.43,39.69 C.4
LEFTBACKWARD_CIN1: length 47.5
  Top Layer w0.9: v2(80.01,51.49) 80.01,48.56 81.28,47.3 87.14,47.3 后CD.14 ; U3.1 64.77,71.68 65.79,70.66 67.69,70.66 69.85,68.5 69.85,58.34 v2(70.36,57.84)
  Bottom Layer w0.9: v2(80.01,51.49) 80.01,53.52 75.82,57.71 70.49,57.71 v2(70.36,57.84)
LEFTBACKWARD_CIN2: length 48.2
  Top Layer w0.9: v2(69.34,56.69) 68.71,57.33 68.71,67.49 66.93,69.27 62.99,69.27 62.23,70.03 U3.2
  Bottom Layer w0.9: 后CD.15 79.5,49.96 78.23,51.23 78.23,53.39 75.18,56.44 69.6,56.44 v2(69.34,56.69)
LEFTFORWARD_A: length 31.8
  Top Layer w0.254: v2(30.48,70.92) 31.75,72.19 U3.14
  Bottom Layer w0.254: A.3 6.97,70.92 v2(30.48,70.92)
LEFTFORWARD_AIN1: length 50.5
  Top Layer w0.9: v2(54.61,80.95) 54.59,80.93 54.59,77.67 U3.5
  Bottom Layer w0.9: v2(54.61,80.95) 54.61,85.38 55.51,86.28 81.15,86.28 83.44,84 83.44,76.26 85.99,73.71 前AB.14
LEFTFORWARD_AIN2: length 59.2
  Top Layer w0.9: U3.8 46.86,77.78 v2(46.86,80.99)
  Bottom Layer w0.9: v2(46.86,80.99) 46.86,86.54 48.26,87.94 82.17,87.94 84.96,85.14 84.96,77.65 86.36,76.25 87.26,76.25
LEFTFORWARD_B: length 30.5
  Top Layer w0.254: U3.15 29.21,71.04 27.43,69.27 v2(24,69.27)
  Bottom Layer w0.254: A.4 6.62,69.27 v2(24,69.27)
RIGHTBACKWARD_A: length 71.2
  Top Layer w0.254: v2(58.55,53.14) 71.12,53.14 73.28,55.3 v2(73.28,58.72) ; D.3 93.63,39.93 v2(89.92,39.93)
  Bottom Layer w0.254: v2(89.92,39.93) 89.15,40.69 89.15,50.09 88.14,51.11 81.79,51.11 81.03,51.87 81.03,54.03 76.33,58.72 v2(73.28,58.72) ; v2(58.55,53.14) 51.94,53.14 49.53,55.55 U3.34
RIGHTBACKWARD_B: length 94.5
  Top Layer w0.254: v2(49.02,65.2) 49.02,65.27 46.85,67.44 37.5,67.44 35.4,65.33 27.56,65.33 26.67,64.44 U3.25
  Bottom Layer w0.254: D.4 92.46,40.27 92.46,37.39 90.93,35.86 79.38,35.86 73.79,41.45 73.79,45.26 72.77,46.28 67.95,46.28 60.2,54.03 52.45,54.03 50.8,55.68 50.8,63.42 v2(49.02,65.2)
RIGHTBACKWARD_DIN1: length 58.5
  Top Layer w0.9: U3.3 59.69,69.65 61.59,67.74 66.29,67.74 67.56,66.47 67.56,56.31 v2(68.45,55.42)
  Bottom Layer w0.9: 后CD.12 77.72,42.34 76.58,43.48 76.58,53.14 74.42,55.3 68.58,55.3 v2(68.45,55.42)
RIGHTBACKWARD_DIN2: length 62.4
  Top Layer w0.9: U3.4 57.15,69.52 60.32,66.34 65.51,66.34 66.42,65.43 66.42,55.3 v2(67.44,54.28)
  Bottom Layer w0.9: v2(67.44,54.28) 73.41,54.28 75.18,52.5 75.18,42.34 77.72,39.8 后CD.11
RIGHTFORWARD_A: length 89.6
  Top Layer w0.254: U3.29 36.83,65.84 v2(37.85,66.85)
  Bottom Layer w0.254: B.3 91.49,67.28 91.14,67.28 90.37,68.05 90.37,70.14 88.3,72.21 84.17,72.21 82.39,74 82.39,83.65 81.03,85.01 69.85,85.01 68.29,83.46 68.29,73.29 65.77,70.77 42.78,70.77 38.87,66.85 v2(37.85,66.85)
RIGHTFORWARD_B: length 82.9
  Top Layer w0.254: v2(89.79,69.9) 90.04,69.9 91.81,71.66 B.4
  Bottom Layer w0.254: v2(89.79,69.9) 85.98,69.9 81.79,74.09 81.79,83.11 80.65,84.25 71.37,84.25 69.47,82.35 69.47,73.58 66.12,70.23 43.26,70.23 39.37,66.34 U3.30
RIGHTFORWARD_BIN1: length 77.1
  Top Layer w0.9: v2(78.49,80.7) 76.96,82.22 27.57,82.22 26.67,81.32 U3.16
  Bottom Layer w0.9: 前AB.12 87.01,68.38 79.5,68.38 78.49,69.39 v2(78.49,80.7)
RIGHTFORWARD_BIN2: length 83.9
  Top Layer w0.9: U3.17 24.13,82.59 25.03,83.49 v2(75.82,83.49)
  Bottom Layer w0.9: 前AB.11 87.14,66.22 78.99,66.22 76.71,68.5 76.71,82.6 v2(75.82,83.49)
TIM2_CH1: length 48.1
  Top Layer w0.254: 前AB.16 86.12,79.93 v2(67.31,79.93) ; U3.10 v2(41.91,79.93)
  Bottom Layer w0.254: v2(41.91,79.93) v2(67.31,79.93)
TIM2_CH2: length 59.7
  Top Layer w0.254: U3.11 v2(39.37,79.05) ; v2(73.28,75.11) 70.87,75.11 69.09,76.89 v2(66.68,76.89)
  Bottom Layer w0.254: 前AB.10 79.5,63.55 75.69,67.36 75.69,71.88 73.41,74.17 73.41,74.98 v2(73.28,75.11) ; v2(66.68,76.89) 66.68,78.16 65.66,79.17 39.5,79.17 v2(39.37,79.05)
TIM2_CH3: length 41.2
  Bottom Layer w0.254: 后CD.16 87.14,52.38 83.06,52.38 82.17,53.26 82.17,54.41 77.09,59.49 53.09,59.49 52.07,60.5 U3.35
TIM2_CH4: length 63
  Top Layer w0.254: v2(59.94,38.28) 56.64,38.28 55.5,39.42 55.5,61.52 U3.36 ; 后CD.10 78.23,37.26 v2(71.37,30.4)
  Bottom Layer w0.254: v2(71.37,30.4) 65.66,30.4 62.99,33.07 62.99,35.23 v2(59.94,38.28)
TIM3_CH3: length 88.3
  Top Layer w0.254: v2(45.59,69.65) 45.53,69.71 45.53,80.89 v2(45.47,80.95) ; U3.33 v2(46.99,66.47)
  Bottom Layer w0.254: 47.12,90.6 76.45,90.6 H4.3 ; 47.12,90.6 32.38,90.6 29.08,93.9 23.88,93.9 22.48,92.51 H3.3 ; 47.12,90.6 47.12,89.2 45.72,87.81 45.72,81.08 45.59,80.95 v2(45.47,80.95) ; v2(45.59,69.65) 46.99,68.25 v2(46.99,66.47)
USART1_RX: length 49.4
  Top Layer w0.254: U3.7 50.93,76.25 50.93,52.76 50.55,52.38 50.55,37.01 52.45,35.1 54.65,35.1 B1.2
USART2_RX: length 138.1
  Top Layer w0.254: H5.4 84.33,10.59 84.33,25.07 82.04,27.36 19.18,27.36 13.33,33.2 13.33,54.79 14.73,56.19 33.15,56.19 34.29,57.33 U3.28
USART2_TX: length 134.5
  Top Layer w0.254: U3.27 31.75,58.22 30.48,56.95 13.84,56.95 12.45,55.55 12.45,32.94 18.92,26.47 79.88,26.47 82.04,24.31 82.04,10.34 H5.3
$1N880: length 16.5
  Top Layer w1: L1.1 35.61,34.77 34.74,33.9 D1.1 32.82,33.58 26.92,33.58 25.65,34.86 U1.2
$1N5309: length 3.2
  Top Layer w0.6: LED3.1 6.94,26.76 LED2.2
$1N7844: length 28.8
  Top Layer w0.8: 45.97,43.87 R2.1 45.98,42.6 44.96,41.58 29.84,41.58 29.08,40.82 29.08,37.23 U1.4 ; 45.97,43.87 45.97,44.63 46.04,44.69 C4.2 ; 45.97,43.87 R1.1

## Copper pours and planes (outline as drawn; the poured copper is in the pictures)
GND on Top Layer: -10.54,104.06 119.38,104.06 119.38,-6.55 -10.54,-6.55
GND on Bottom Layer: -11.05,119.3 112.4,119.3 112.4,-35.13 -11.05,-35.13

Small or netless copper shapes (teardrops, artwork), in the pictures only: 98 on Top Layer, 56 on Bottom Layer

## Text on the board
Top Silkscreen Layer: 3.3VLED | + | 3.3V | GND | IO00 | 5V | ALEX | 4
